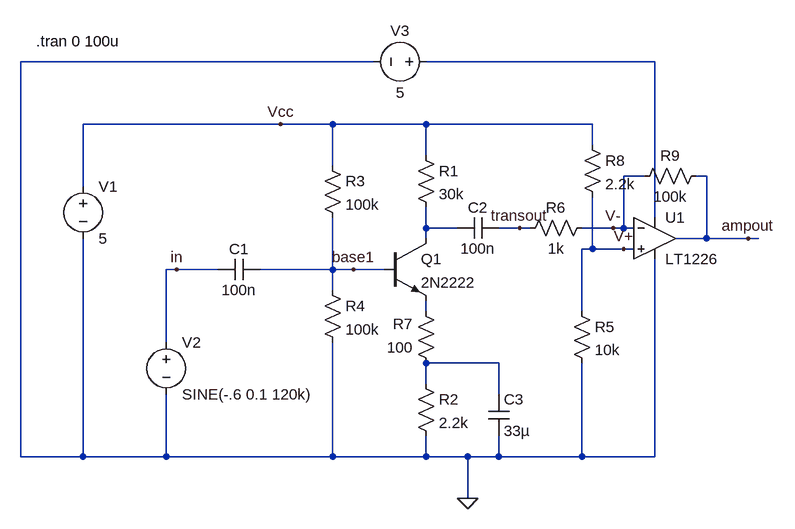
[diagram p0: schematic laserAmpOpAmp1226.asc]
laserAmpOpAmp1226.asc, the LTspice schematic file:
Version 4
SHEET 1 880 688
WIRE 160 0 -384 0
WIRE 592 0 240 0
WIRE 16 96 -288 96
WIRE 96 96 16 96
WIRE 240 96 96 96
WIRE 496 96 240 96
WIRE 496 128 496 96
WIRE 240 144 240 96
WIRE 96 160 96 96
WIRE 576 176 544 176
WIRE 672 176 656 176
WIRE -288 192 -288 96
WIRE 592 240 592 0
WIRE 240 256 240 224
WIRE 288 256 240 256
WIRE 384 256 352 256
WIRE 400 256 384 256
WIRE 528 256 480 256
WIRE 544 256 544 176
WIRE 544 256 528 256
WIRE 560 256 544 256
WIRE 240 272 240 256
WIRE 672 272 672 176
WIRE 672 272 624 272
WIRE 736 272 672 272
WIRE 752 272 736 272
WIRE 496 288 496 208
WIRE 496 288 480 288
WIRE 544 288 496 288
WIRE 560 288 544 288
WIRE -144 320 -160 320
WIRE -80 320 -144 320
WIRE 96 320 96 240
WIRE 96 320 -16 320
WIRE 128 320 96 320
WIRE 176 320 128 320
WIRE 96 352 96 320
WIRE 240 384 240 368
WIRE 480 384 480 288
WIRE -160 432 -160 320
WIRE 352 464 240 464
WIRE 240 496 240 464
WIRE 352 512 352 464
WIRE -384 608 -384 0
WIRE -288 608 -288 272
WIRE -288 608 -384 608
WIRE -160 608 -160 512
WIRE -160 608 -288 608
WIRE 96 608 96 432
WIRE 96 608 -160 608
WIRE 240 608 240 576
WIRE 240 608 96 608
WIRE 304 608 240 608
WIRE 352 608 352 576
WIRE 352 608 304 608
WIRE 480 608 480 464
WIRE 480 608 352 608
WIRE 592 608 592 304
WIRE 592 608 480 608
WIRE 304 672 304 608
FLAG 304 672 0
FLAG -144 320 in
FLAG 384 256 transout
FLAG 16 96 Vcc
FLAG 128 320 base1
FLAG 736 272 ampout
FLAG 544 288 V+
FLAG 528 256 V-
SYMBOL npn 176 272 R0
SYMATTR InstName Q1
SYMATTR Value 2N2222
SYMBOL res 224 128 R0
SYMATTR InstName R1
SYMATTR Value 30k
SYMBOL res 224 480 R0
SYMATTR InstName R2
SYMATTR Value 2.2k
SYMBOL res 80 144 R0
SYMATTR InstName R3
SYMATTR Value 100k
SYMBOL res 80 336 R0
SYMATTR InstName R4
SYMATTR Value 100k
SYMBOL voltage -288 176 R0
SYMATTR InstName V1
SYMATTR Value 5
SYMBOL voltage -160 416 R0
SYMATTR Value2 AC .
SYMATTR InstName V2
SYMATTR Value SINE(-.6 0.1 120k)
SYMBOL cap -16 336 M270
WINDOW 0 32 32 VTop 2
WINDOW 3 0 32 VBottom 2
SYMATTR InstName C1
SYMATTR Value 100n
SYMBOL cap 352 272 M270
WINDOW 0 32 32 VTop 2
WINDOW 3 0 32 VBottom 2
SYMATTR InstName C2
SYMATTR Value 100n
SYMBOL cap 336 512 R0
SYMATTR InstName C3
SYMATTR Value 33µ
SYMBOL voltage 256 0 R90
WINDOW 0 -32 56 VBottom 2
WINDOW 3 32 56 VTop 2
SYMATTR InstName V3
SYMATTR Value 5
SYMBOL res 464 368 R0
SYMATTR InstName R5
SYMATTR Value 10k
SYMBOL Opamps/LT1226 592 208 R0
SYMATTR InstName U1
SYMBOL res 672 160 R90
WINDOW 0 0 56 VBottom 2
WINDOW 3 32 56 VTop 2
SYMATTR InstName R9
SYMATTR Value 100k
SYMBOL res 496 240 R90
WINDOW 0 0 56 VBottom 2
WINDOW 3 32 56 VTop 2
SYMATTR InstName R6
SYMATTR Value 1k
SYMBOL res 480 112 R0
SYMATTR InstName R8
SYMATTR Value 2.2k
SYMBOL res 256 480 R180
WINDOW 0 36 76 Left 2
WINDOW 3 36 40 Left 2
SYMATTR InstName R7
SYMATTR Value 100
TEXT -360 -32 Left 2 !.tran 0 100u

The netlist it stands for:
* laserAmpOpAmp1226.asc
Q1 N002 base1 N003 0 2N2222
R1 Vcc N002 30k
R2 N004 0 2.2k
R3 Vcc base1 100k
R4 base1 0 100k
V1 Vcc 0 5
V2 in 0 SINE(-.6 0.1 120k) AC .
C1 base1 in 100n
C2 transout N002 100n
C3 N004 0 33µ
V3 N001 0 5
R5 V+ 0 10k
XU1 V+ V- N001 0 ampout LT1226  ; pins In+ In- V+ V- OUT
R9 ampout V- 100k
R6 V- transout 1k
R8 Vcc V+ 2.2k
R7 N004 N003 100
.model NPN NPN
.model PNP PNP
.lib standard.bjt
.tran 0 100u
.backanno
.end